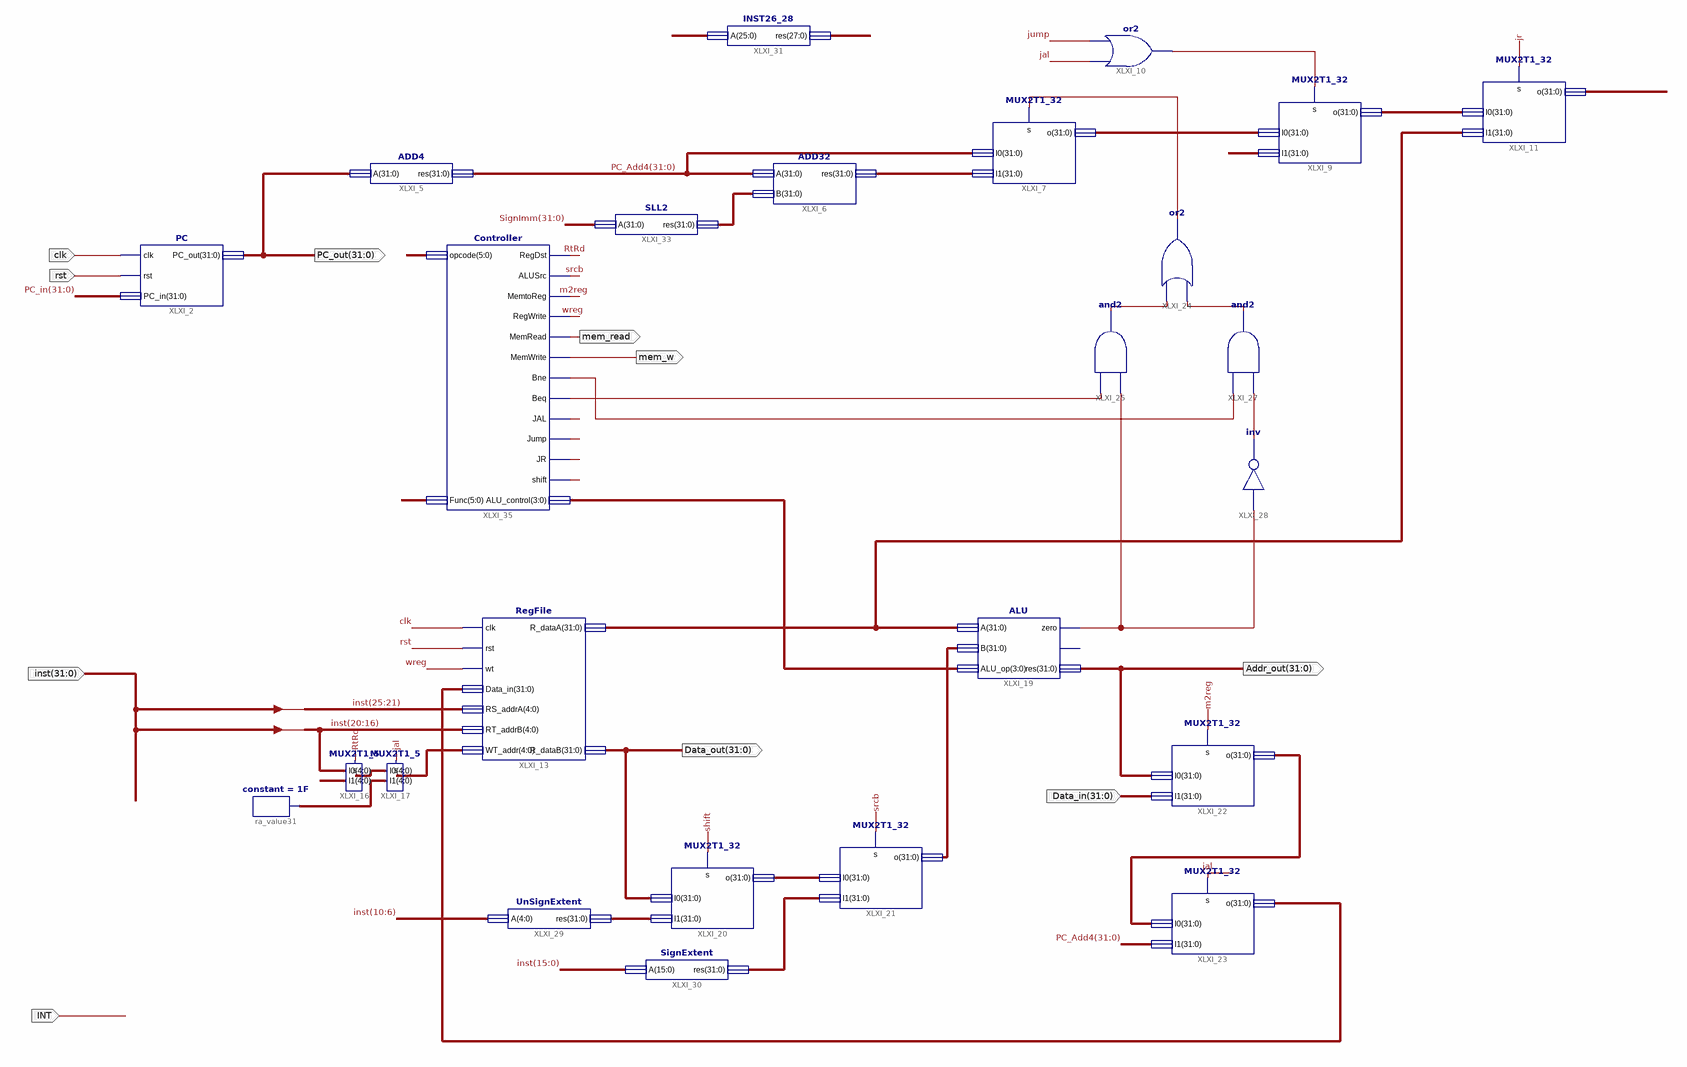
[diagram p0: schematic sheet 1]
// Xilinx ISE schematic SCPU_TOP.sch (kintex7) as structural Verilog: 25 symbols, 10 ports
module SCPU_TOP (
  input  clk,
  input  rst,
  input  [31:0] inst,
  input  [31:0] Data_in,
  input  INT,
  output [31:0] PC_out,
  output mem_w,
  output [31:0] Addr_out,
  output [31:0] Data_out,
  output mem_read
);

  wire jal, jr, jump, m2reg, RtRd, shift, srcb, wreg, XLXN_13, XLXN_53, XLXN_54, XLXN_55, XLXN_60, XLXN_61,
       XLXN_94, XLXN_95;
  wire [3:0] XLXN_42;
  wire [4:0] constant31, XLXN_31, XLXN_36;
  wire [27:0] Addr_Ext;
  wire [31:0] PC_Add4, PC_in, SignImm, XLXN_8, XLXN_12, XLXN_16, XLXN_37, XLXN_38, XLXN_39, XLXN_51, XLXN_65,
       XLXN_68, XLXN_81;

  PC XLXI_2 (.clk(clk), .rst(rst), .PC_in(PC_in), .PC_out(PC_out));
  ADD4 XLXI_5 (.A(PC_out), .res(PC_Add4));
  ADD32 XLXI_6 (.A(PC_Add4), .B(XLXN_81), .res(XLXN_8));
  MUX2T1_32 XLXI_7 (.I0(PC_Add4), .I1(XLXN_8), .o(XLXN_12), .s(XLXN_53));
  MUX2T1_32 XLXI_9 (.I0(XLXN_12), .I1({PC_Add4[31:28], Addr_Ext}), .o(XLXN_16), .s(XLXN_13));
  or XLXI_10 (XLXN_13, jal, jump);
  MUX2T1_32 XLXI_11 (.I0(XLXN_16), .I1(XLXN_37), .o(PC_in), .s(jr));
  RegFile XLXI_13 (
    .clk(clk), .rst(rst), .wt(wreg), .Data_in(XLXN_65), .RS_addrA(inst[25:21]), .RT_addrB(inst[20:16]),
    .WT_addr(XLXN_36), .R_dataA(XLXN_37), .R_dataB(Data_out));
  MUX2T1_5 XLXI_16 (.I1(inst[15:11]), .I0(inst[20:16]), .o(XLXN_31), .s(RtRd));
  MUX2T1_5 XLXI_17 (.I1(constant31), .I0(XLXN_31), .o(XLXN_36), .s(jal));
  ALU XLXI_19 (.A(XLXN_37), .B(XLXN_38), .ALU_op(XLXN_42), .zero(XLXN_60), .res(Addr_out));  // open: overflow
  MUX2T1_32 XLXI_21 (.I0(XLXN_39), .I1(SignImm), .o(XLXN_38), .s(srcb));
  MUX2T1_32 XLXI_22 (.I0(Addr_out), .I1(Data_in), .o(XLXN_51), .s(m2reg));
  MUX2T1_32 XLXI_20 (.I0(Data_out), .I1(XLXN_68), .o(XLXN_39), .s(shift));
  MUX2T1_32 XLXI_23 (.I0(XLXN_51), .I1(PC_Add4), .o(XLXN_65), .s(jal));
  or XLXI_24 (XLXN_53, XLXN_55, XLXN_54);
  and XLXI_25 (XLXN_54, XLXN_60, XLXN_94);
  and XLXI_27 (XLXN_55, XLXN_61, XLXN_95);
  not XLXI_28 (XLXN_61, XLXN_60);
  UnSignExtent XLXI_29 (.A(inst[10:6]), .res(XLXN_68));
  SignExtent XLXI_30 (.A(inst[15:0]), .res(SignImm));
  INST26_28 XLXI_31 (.A(inst[25:0]), .res(Addr_Ext));
  SLL2 XLXI_33 (.A(SignImm), .res(XLXN_81));
  constant #(.CValue("1F")) ra_value31 (.O(constant31));
  Controller XLXI_35 (
    .opcode(inst[31:26]), .Func(inst[5:0]), .RegDst(RtRd), .ALUSrc(srcb), .MemtoReg(m2reg), .RegWrite(wreg),
    .MemRead(mem_read), .MemWrite(mem_w), .Bne(XLXN_95), .Beq(XLXN_94), .JAL(jal), .Jump(jump), .JR(jr),
    .shift(shift), .ALU_control(XLXN_42));
endmodule
